# Altium schematic sheet Main.SchDoc
size A
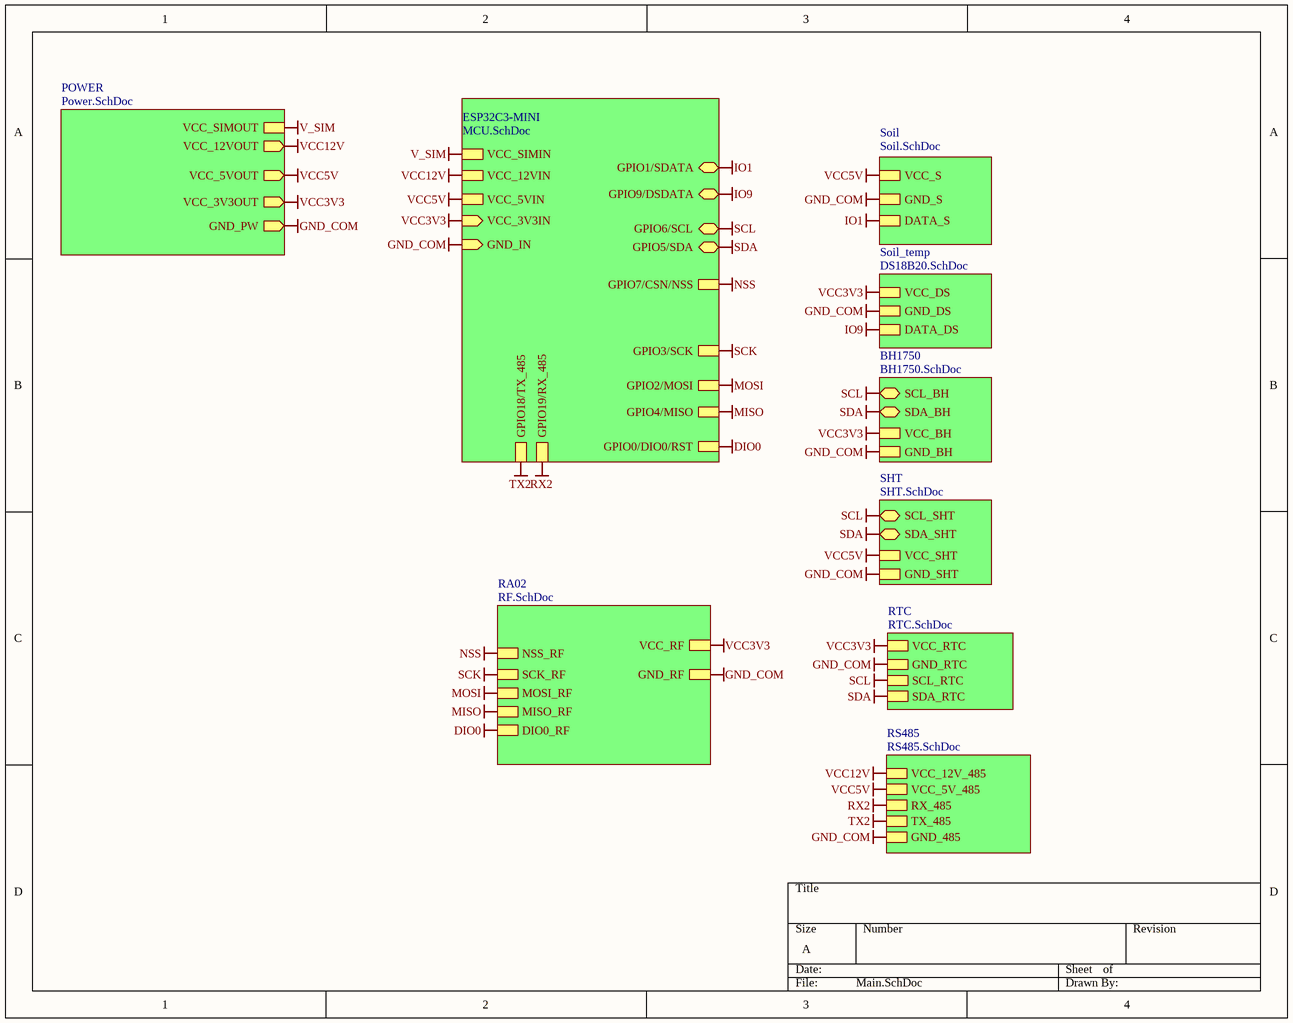
[diagram p0: Main.SchDoc]

## Sub-sheets
BH1750 = BH1750.SchDoc: SCL_BH (bidir), SDA_BH (bidir), VCC_BH, GND_BH
ESP32C3-MINI = MCU.SchDoc: VCC_3V3IN (in), GND_IN (in), GPIO1/SDATA (bidir), GPIO9/DSDATA (bidir), GPIO6/SCL (bidir), GPIO5/SDA (bidir), VCC_5VIN, VCC_12VIN, GPIO18/TX_485, GPIO19/RX_485, VCC_SIMIN, GPIO0/DIO0/RST, GPIO2/MOSI, GPIO3/SCK, GPIO7/CSN/NSS, GPIO4/MISO
POWER = Power.SchDoc: VCC_12VOUT (out), VCC_5VOUT (out), VCC_3V3OUT (out), GND_PW (out), VCC_SIMOUT
RA02 = RF.SchDoc: NSS_RF, SCK_RF, MOSI_RF, MISO_RF, DIO0_RF, VCC_RF, GND_RF
RS485 = RS485.SchDoc: VCC_12V_485, VCC_5V_485, RX_485, TX_485, GND_485
RTC = RTC.SchDoc: VCC_RTC, GND_RTC, SCL_RTC, SDA_RTC
SHT = SHT.SchDoc: SCL_SHT (bidir), SDA_SHT (bidir), VCC_SHT, GND_SHT
Soil = Soil.SchDoc: VCC_S, GND_S, DATA_S
Soil_temp = DS18B20.SchDoc: VCC_DS, GND_DS, DATA_DS

## Nets
DIO0: sheet ESP32C3-MINI/GPIO0/DIO0/RST, sheet RA02/DIO0_RF
GND_COM: sheet ESP32C3-MINI/GND_IN, sheet POWER/GND_PW, sheet RTC/GND_RTC, sheet Soil/GND_S, sheet Soil_temp/GND_DS, sheet BH1750/GND_BH, sheet SHT/GND_SHT, sheet RS485/GND_485, sheet RA02/GND_RF
IO1: sheet ESP32C3-MINI/GPIO1/SDATA, sheet Soil/DATA_S
IO9: sheet ESP32C3-MINI/GPIO9/DSDATA, sheet Soil_temp/DATA_DS
MISO: sheet ESP32C3-MINI/GPIO4/MISO, sheet RA02/MISO_RF
MOSI: sheet ESP32C3-MINI/GPIO2/MOSI, sheet RA02/MOSI_RF
NSS: sheet ESP32C3-MINI/GPIO7/CSN/NSS, sheet RA02/NSS_RF
RX2: sheet ESP32C3-MINI/GPIO19/RX_485, sheet RS485/RX_485
SCK: sheet ESP32C3-MINI/GPIO3/SCK, sheet RA02/SCK_RF
SCL: sheet ESP32C3-MINI/GPIO6/SCL, sheet RTC/SCL_RTC, sheet BH1750/SCL_BH, sheet SHT/SCL_SHT
SDA: sheet ESP32C3-MINI/GPIO5/SDA, sheet RTC/SDA_RTC, sheet BH1750/SDA_BH, sheet SHT/SDA_SHT
TX2: sheet ESP32C3-MINI/GPIO18/TX_485, sheet RS485/TX_485
V_SIM: sheet ESP32C3-MINI/VCC_SIMIN, sheet POWER/VCC_SIMOUT
VCC3V3: sheet ESP32C3-MINI/VCC_3V3IN, sheet POWER/VCC_3V3OUT, sheet RTC/VCC_RTC, sheet Soil_temp/VCC_DS, sheet BH1750/VCC_BH, sheet RA02/VCC_RF
VCC5V: sheet ESP32C3-MINI/VCC_5VIN, sheet POWER/VCC_5VOUT, sheet Soil/VCC_S, sheet SHT/VCC_SHT, sheet RS485/VCC_5V_485
VCC12V: sheet ESP32C3-MINI/VCC_12VIN, sheet POWER/VCC_12VOUT, sheet RS485/VCC_12V_485